# EAGLE design keyboard (EAGLE 7.2.0)
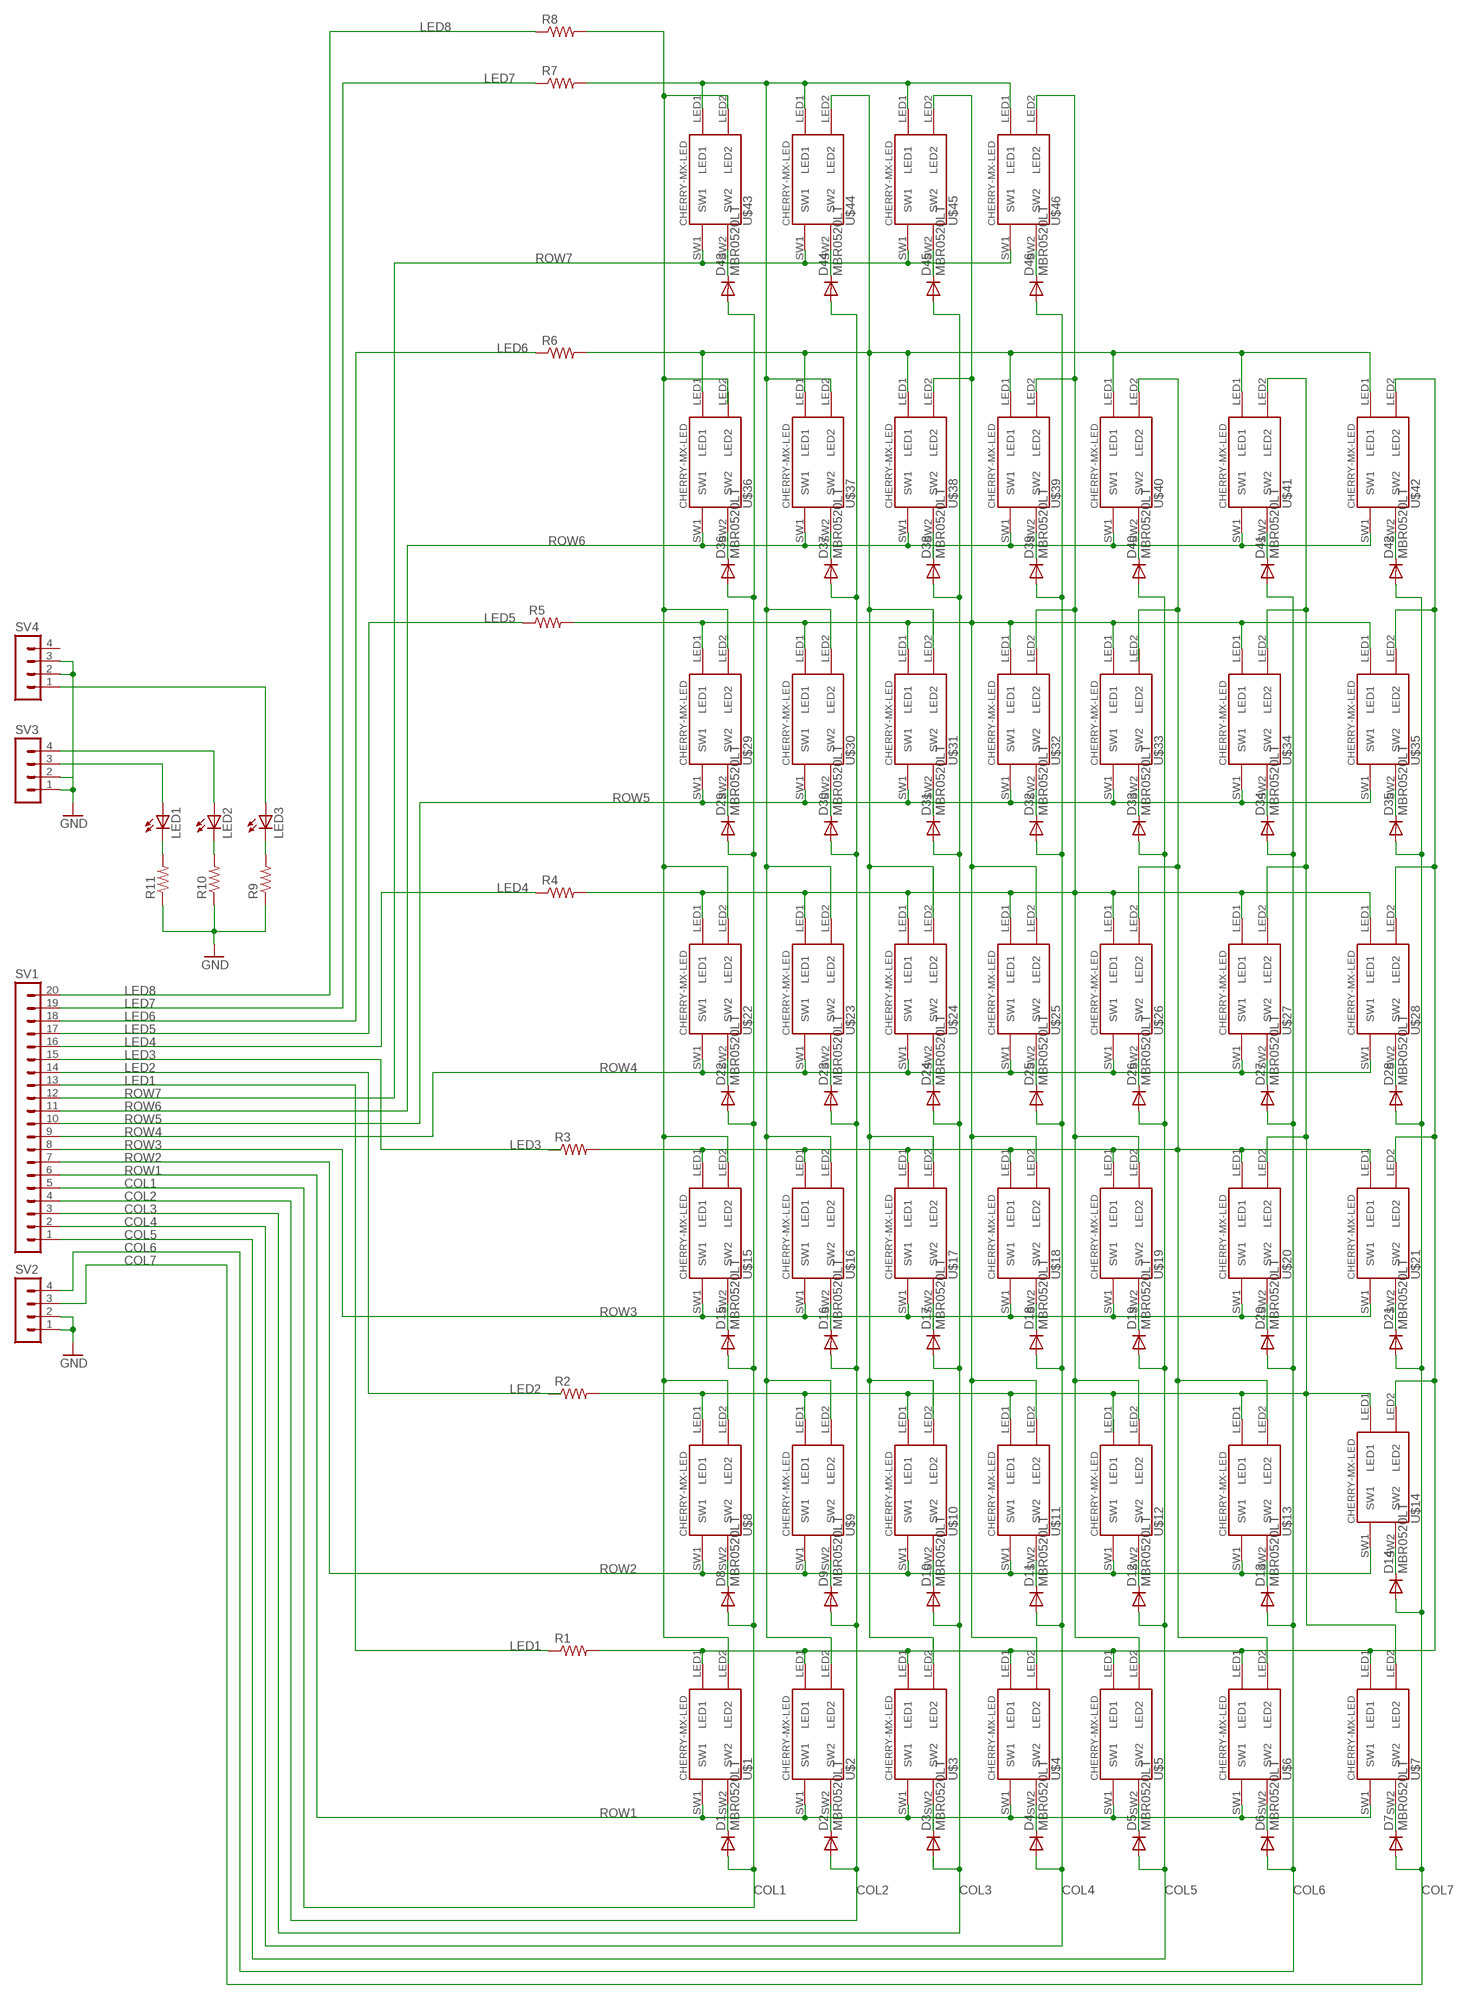
[diagram p0: schematic, sheet 1]

## Parts
D1  MBR0520LT  [SOD123]
D2  MBR0520LT  [SOD123]
D3  MBR0520LT  [SOD123]
D4  MBR0520LT  [SOD123]
D5  MBR0520LT  [SOD123]
D6  MBR0520LT  [SOD123]
D7  MBR0520LT  [SOD123]
D8  MBR0520LT  [SOD123]
D9  MBR0520LT  [SOD123]
D10  MBR0520LT  [SOD123]
D11  MBR0520LT  [SOD123]
D12  MBR0520LT  [SOD123]
D13  MBR0520LT  [SOD123]
D14  MBR0520LT  [SOD123]
D15  MBR0520LT  [SOD123]
D16  MBR0520LT  [SOD123]
D17  MBR0520LT  [SOD123]
D18  MBR0520LT  [SOD123]
D19  MBR0520LT  [SOD123]
D20  MBR0520LT  [SOD123]
D21  MBR0520LT  [SOD123]
D22  MBR0520LT  [SOD123]
D23  MBR0520LT  [SOD123]
D24  MBR0520LT  [SOD123]
D25  MBR0520LT  [SOD123]
D26  MBR0520LT  [SOD123]
D27  MBR0520LT  [SOD123]
D28  MBR0520LT  [SOD123]
D29  MBR0520LT  [SOD123]
D30  MBR0520LT  [SOD123]
D31  MBR0520LT  [SOD123]
D32  MBR0520LT  [SOD123]
D33  MBR0520LT  [SOD123]
D34  MBR0520LT  [SOD123]
D35  MBR0520LT  [SOD123]
D36  MBR0520LT  [SOD123]
D37  MBR0520LT  [SOD123]
D38  MBR0520LT  [SOD123]
D39  MBR0520LT  [SOD123]
D40  MBR0520LT  [SOD123]
D41  MBR0520LT  [SOD123]
D42  MBR0520LT  [SOD123]
D43  MBR0520LT  [SOD123]
D44  MBR0520LT  [SOD123]
D45  MBR0520LT  [SOD123]
D46  MBR0520LT  [SOD123]
LED1  LED5MM  [LED5MM]
LED2  LED5MM  [LED5MM]
LED3  LED5MM  [LED5MM]
R1  R-US_R0603  [R0603]
R2  R-US_R0603  [R0603]
R3  R-US_R0603  [R0603]
R4  R-US_R0603  [R0603]
R5  R-US_R0603  [R0603]
R6  R-US_R0603  [R0603]
R7  R-US_R0603  [R0603]
R8  R-US_R0603  [R0603]
R9  R-US_R0603  [R0603]
R10  R-US_R0603  [R0603]
R11  R-US_R0603  [R0603]
SV1  MA20-1  [MA20-1]
SV2  MA04-1  [MA04-1]
SV3  MA04-1  [MA04-1]
SV4  MA04-1  [MA04-1]
U$1  CHERRY-MX-LED  [CHERRY-MX-LED]
U$2  CHERRY-MX-LED  [CHERRY-MX-LED]
U$3  CHERRY-MX-LED  [CHERRY-MX-LED]
U$4  CHERRY-MX-LED  [CHERRY-MX-LED]
U$5  CHERRY-MX-LED  [CHERRY-MX-LED]
U$6  CHERRY-MX-LED  [CHERRY-MX-LED]
U$7  CHERRY-MX-LED  [CHERRY-MX-LED]
U$8  CHERRY-MX-LED  [CHERRY-MX-LED]
U$9  CHERRY-MX-LED  [CHERRY-MX-LED]
U$10  CHERRY-MX-LED  [CHERRY-MX-LED]
U$11  CHERRY-MX-LED  [CHERRY-MX-LED]
U$12  CHERRY-MX-LED  [CHERRY-MX-LED]
U$13  CHERRY-MX-LED  [CHERRY-MX-LED]
U$14  CHERRY-MX-LED  [CHERRY-MX-LED]
U$15  CHERRY-MX-LED  [CHERRY-MX-LED]
U$16  CHERRY-MX-LED  [CHERRY-MX-LED]
U$17  CHERRY-MX-LED  [CHERRY-MX-LED]
U$18  CHERRY-MX-LED  [CHERRY-MX-LED]
U$19  CHERRY-MX-LED  [CHERRY-MX-LED]
U$20  CHERRY-MX-LED  [CHERRY-MX-LED]
U$21  CHERRY-MX-LED  [CHERRY-MX-LED]
U$22  CHERRY-MX-LED  [CHERRY-MX-LED]
U$23  CHERRY-MX-LED  [CHERRY-MX-LED]
U$24  CHERRY-MX-LED  [CHERRY-MX-LED]
U$25  CHERRY-MX-LED  [CHERRY-MX-LED]
U$26  CHERRY-MX-LED  [CHERRY-MX-LED]
U$27  CHERRY-MX-LED  [CHERRY-MX-LED]
U$28  CHERRY-MX-LED  [CHERRY-MX-LED]
U$29  CHERRY-MX-LED  [CHERRY-MX-LED]
U$30  CHERRY-MX-LED  [CHERRY-MX-LED]
U$31  CHERRY-MX-LED  [CHERRY-MX-LED]
U$32  CHERRY-MX-LED  [CHERRY-MX-LED]
U$33  CHERRY-MX-LED  [CHERRY-MX-LED]
U$34  CHERRY-MX-LED  [CHERRY-MX-LED]
U$35  CHERRY-MX-LED  [CHERRY-MX-LED]
U$36  CHERRY-MX-LED  [CHERRY-MX-LED]
U$37  CHERRY-MX-LED  [CHERRY-MX-LED]
U$38  CHERRY-MX-LED  [CHERRY-MX-LED]
U$39  CHERRY-MX-LED  [CHERRY-MX-LED]
U$40  CHERRY-MX-LED  [CHERRY-MX-LED]
U$41  CHERRY-MX-LED  [CHERRY-MX-LED]
U$42  CHERRY-MX-LED  [CHERRY-MX-LED]
U$43  CHERRY-MX-LED  [CHERRY-MX-LED]
U$44  CHERRY-MX-LED  [CHERRY-MX-LED]
U$45  CHERRY-MX-LED  [CHERRY-MX-LED]
U$46  CHERRY-MX-LED  [CHERRY-MX-LED]

## Nets
COL1: D1.A D8.A D15.A D22.A D29.A D36.A D43.A SV1.5
COL2: D2.A D9.A D16.A D23.A D30.A D37.A D44.A SV1.4
COL3: D3.A D10.A D17.A D24.A D31.A D38.A D45.A SV1.3
COL4: D4.A D11.A D18.A D25.A D32.A D39.A D46.A SV1.2
COL5: D5.A D12.A D19.A D26.A D33.A D40.A SV1.1
COL6: D6.A D13.A D20.A D27.A D34.A D41.A
COL7: D7.A D14.A D21.A D28.A D35.A D42.A SV2.3
GND: R9.1 R10.1 R11.1 SV2.1 SV2.2 SV3.1 SV3.2 SV4.2 SV4.3
LED1: R1.1 SV1.13
LED2: SV1.14
LED3: SV1.15
LED4: R4.1 SV1.16
LED5: R5.1 SV1.17
LED6: R6.1 SV1.18
LED7: R7.1 SV1.19
LED8: R8.1 SV1.20
N$1: D8.C U$8.SW2
N$2: D9.C U$9.SW2
N$3: D10.C U$10.SW2
N$4: D11.C U$11.SW2
N$5: D12.C U$12.SW2
N$6: D13.C U$13.SW2
N$7: D14.C U$14.SW2
N$8: D7.C U$7.SW2
N$9: D6.C U$6.SW2
N$10: D5.C U$5.SW2
N$11: D4.C U$4.SW2
N$12: D3.C U$3.SW2
N$13: D2.C U$2.SW2
N$14: D1.C U$1.SW2
N$15: D15.C U$15.SW2
N$16: D16.C U$16.SW2
N$17: D17.C U$17.SW2
N$18: D18.C U$18.SW2
N$19: D19.C U$19.SW2
N$20: D20.C U$20.SW2
N$21: D21.C U$21.SW2
N$22: D22.C
N$23: D23.C
N$24: D24.C
N$25: D25.C
N$26: D26.C
N$27: D27.C U$27.SW2
N$28: D28.C U$28.SW2
N$29: D29.C U$29.SW2
N$30: D30.C U$30.SW2
N$31: D31.C U$31.SW2
N$32: D32.C U$32.SW2
N$33: D33.C U$33.SW2
N$34: D34.C U$34.SW2
N$35: D35.C U$35.SW2
N$36: D36.C U$36.SW2
N$37: D37.C U$37.SW2
N$38: D38.C U$38.SW2
N$39: D39.C U$39.SW2
N$40: D40.C U$40.SW2
N$41: D41.C U$41.SW2
N$42: D42.C U$42.SW2
N$43: D43.C U$43.SW2
N$44: D44.C U$44.SW2
N$45: D45.C U$45.SW2
N$46: D46.C U$46.SW2
N$48: LED1.K(C) R11.2
N$49: R8.2 U$1.LED2 U$8.LED2 U$15.LED2 U$22.LED2 U$29.LED2 U$43.LED2
N$50: R1.2 U$1.LED1 U$2.LED1 U$3.LED1 U$4.LED1 U$5.LED1 U$6.LED1 U$7.LED1 U$14.LED2 U$21.LED2 U$28.LED2 U$35.LED2 U$42.LED2
N$51: R4.2 U$5.LED2 U$12.LED2 U$19.LED2 U$22.LED1 U$23.LED1 U$24.LED1 U$25.LED1 U$26.LED1 U$27.LED1 U$28.LED1 U$32.LED2 U$39.LED2 U$46.LED2
N$52: R5.2 U$4.LED2 U$11.LED2 U$18.LED2 U$25.LED2 U$29.LED1 U$30.LED1 U$31.LED1 U$32.LED1 U$33.LED1 U$34.LED1 U$35.LED1 U$38.LED2 U$45.LED2
N$53: R6.2 U$3.LED2 U$10.LED2 U$17.LED2 U$24.LED2 U$31.LED2 U$36.LED1 U$37.LED1 U$38.LED1 U$39.LED1 U$40.LED1 U$41.LED1 U$42.LED1 U$44.LED2
N$54: LED2.K(C) R10.2
N$55: LED3.K(C) R9.2
N$58: LED1.A SV3.3
N$59: LED2.A SV3.4
N$60: LED3.A SV4.1
N$64: R7.2 U$2.LED2 U$9.LED2 U$16.LED2 U$23.LED2 U$30.LED2 U$37.LED2 U$43.LED1 U$44.LED1 U$45.LED1 U$46.LED1
N$75: R2.2 U$7.LED2 U$8.LED1 U$9.LED1 U$10.LED1 U$11.LED1 U$13.LED1 U$14.LED1 U$20.LED2 U$27.LED2 U$34.LED2 U$41.LED2
N$76: R3.2 U$6.LED2 U$13.LED2 U$15.LED1 U$16.LED1 U$17.LED1 U$18.LED1 U$19.LED1 U$20.LED1 U$21.LED1 U$26.LED2 U$40.LED2
ROW1: SV1.6 U$1.SW1 U$2.SW1 U$3.SW1 U$4.SW1 U$5.SW1 U$6.SW1 U$7.SW1
ROW2: SV1.7 U$8.SW1 U$9.SW1 U$10.SW1 U$11.SW1 U$12.SW1 U$13.SW1 U$14.SW1
ROW3: SV1.8 U$15.SW1 U$16.SW1 U$17.SW1 U$18.SW1 U$19.SW1 U$20.SW1 U$21.SW1
ROW4: SV1.9 U$22.SW1 U$23.SW1 U$24.SW1 U$25.SW1 U$26.SW1 U$27.SW1 U$28.SW1
ROW5: SV1.10 U$29.SW1 U$30.SW1 U$31.SW1 U$32.SW1 U$33.SW1 U$34.SW1 U$35.SW1
ROW6: SV1.11 U$36.SW1 U$37.SW1 U$38.SW1 U$39.SW1 U$40.SW1 U$41.SW1 U$42.SW1
ROW7: SV1.12 U$43.SW1 U$44.SW1 U$45.SW1 U$46.SW1
Unconnected: R2.1 R3.1 SV2.4 SV4.4 U$12.LED1 U$22.SW2 U$23.SW2 U$24.SW2 U$25.SW2 U$26.SW2 U$33.LED2 U$36.LED2

## Library data of the parts
D1-D46 = dan:MBR0520LT: SCHOTTKY BARRIER RECTIFIER Source: http://onsemi.com .. MBR0520LT1-D.pdf
LED1-LED3 = dan:LED: LED OSRAM: - CHIPLED LG R971, LG N971, LY N971, LG Q971, LY Q971, LO R971, LY R971 LH N974, LH R974 LS Q976, LO Q976, LY Q976 LO Q996 - Hyper CHIPLED LW Q18S LB Q993, LB Q99A, LB R99A - SideLED LS A670, LO A670, LY A670, LG A670, LP A670 LB A673, LV A673, LT A673, LW A673 LH A674 LY A675 LS A676, LA A676, LO A676, LY A676, LW A676 LS A679, LY A679, LG A679 - Hyper Micro SIDELED® LS Y876, LA Y876, LO Y876, LY Y876 LT Y87S - SmartLED LW L88C, LW L88S LB L89C, LB L89S, LG L890 LS L89K, LO L89K, LY L89K LS L896, LA L896, LO L896, LY L896 - TOPLED LS T670, LO T670, LY T670, LG T670, LP T670 LSG T670, LSP T670, LSY T670, LOP T670, LYG T670 LG T671, LOG T671, LSG T671 LB T673, LV T673, LT T673, LW T673 LH T674 LS T676, LA T676, LO T676, LY T676, LB T676, LH T676, LSB T676, LW T676 LB T67C, LV T67C, LT T67C, LS T67K, LO T67K, LY T67K, LW E67C LS E67B, LA E67B, LO E67B, LY E67B, LB E67C, LV E67C, LT E67C LW T67C LS T679, LY T679, LG T679 LS T770, LO T770, LY T770, LG T770, LP T770 LB T773, LV T773, LT T773, LW T773 LH T774 LS E675, LA E675, LY E675, LS T675 LS T776, LA T776, LO T776, LY T776, LB T776 LHGB T686 LT T68C, LB T68C - Hyper Mini TOPLED® LB M676 - Mini TOPLED Santana® LG M470 LS M47K, LO M47K, LY M47K Source: http://www.osram.convergy.de LUXEON: - LUMILED® LXK2-PW12-R00, LXK2-PW12-S00, LXK2-PW14-U00, LXK2-PW14-V00 LXK2-PM12-R00, LXK2-PM12-S00, LXK2-PM14-U00 LXK2-PE12-Q00, LXK2-PE12-R00, LXK2-PE12-S00, LXK2-PE14-T00, LXK2-PE14-U00 LXK2-PB12-K00, LXK2-PB12-L00, LXK2-PB12-M00, LXK2-PB14-N00, LXK2-PB14-P00, LXK2-PB14-Q00 LXK2-PR12-L00, LXK2-PR12-M00, LXK2-PR14-Q00, LXK2-PR14-R00 LXK2-PD12-Q00, LXK2-PD12-R00, LXK2-PD12-S00 LXK2-PH12-R00, LXK2-PH12-S00 LXK2-PL12-P00, LXK2-PL12-Q00, LXK2-PL12-R00 Source: www.luxeon.com KINGBRIGHT: KA-3528ASYC Source: www.kingbright.com
R1-R11 = dan:R-US_: RESISTOR, American symbol
SV1 = dan:MA20-1: PIN HEADER; OC_FARNELL: unknown; OC_NEWARK: unknown
SV2-SV4 = dan:MA04-1: PIN HEADER; OC_FARNELL: unknown; OC_NEWARK: unknown
U$1-U$46 = dan:CHERRY-MX-LED: Cherry MX series keyswitch with LED

## Board
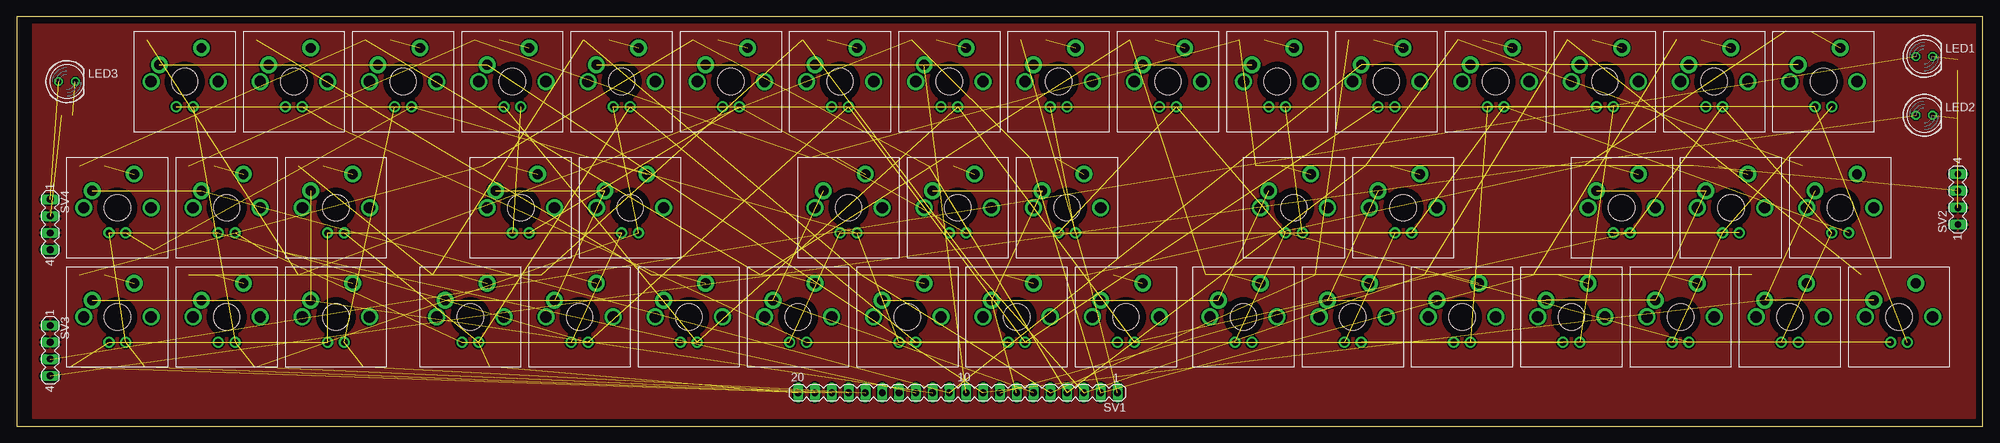
[diagram p1: board, top side]
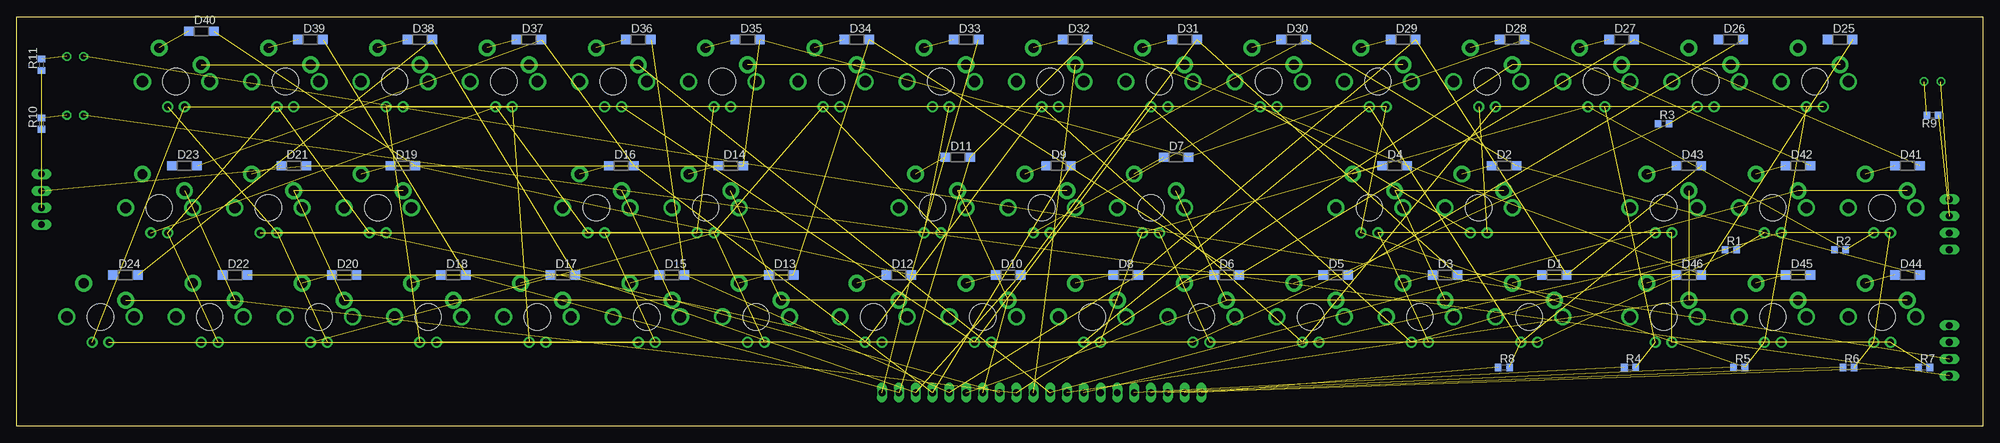
[diagram p2: board, bottom side, seen from below]

Size 297.16 x 61.9 mm. Coordinates in mm from the lower left corner, seen from the top.
Outline: 0,0 297.16,0 297.16,61.9 0,61.9 0,0
Copper layers (1*16): Top 0.035mm / dielectric 1.5mm / Bottom 0.035mm
Design rules "default": minimum track width 10mil, minimum drill 24mil, track to track 8mil, track to pad 8mil, pad to pad 8mil, via to via 8mil, smd to smd 8mil, copper to edge 40mil, drill to drill 8mil, minimum pad ring 10mil, minimum via ring 8mil, stop-mask expansion 4mil, vias tented up to drill 0mil, thermal gap 10mil

### Footprints (pad centres in the part's own frame; a part is rotated, then mirrored left to right if it is on the bottom)
SOD123 = smd 1.4 x 1.4: A 1.9,0; C -1.9,0
LED5MM = drill 0.813 octagon: A -1.27,0; K 1.27,0
R0603 = smd 1 x 1.1: 1 -0.85,0; 2 0.85,0
MA20-1 = drill 1.016 long: 1 -24.13,0; 2 -21.59,0; 3 -19.05,0; 4 -16.51,0; 5 -13.97,0; 6 -11.43,0; 7 -8.89,0; 8 -6.35,0; 9 -3.81,0; 10 -1.27,0; 11 1.27,0; 12 3.81,0; 13 6.35,0; 14 8.89,0; 15 11.43,0; 16 13.97,0; 17 16.51,0; 18 19.05,0; 19 21.59,0; 20 24.13,0
MA04-1 = drill 1.016 long: 1 -3.81,0; 2 -1.27,0; 3 1.27,0; 4 3.81,0
CHERRY-MX-LED = drill 1.016 pad 1.676: LED1 -1.27,-3.81; LED2 1.27,-3.81 | drill 1.714 pad 1.93: P$3 -5.08,0; P$4 5.08,0 | drill 1.5 pad 2.54: SW1 -3.81,2.54; SW2 2.54,5.08 | hole 4: 0,0

### Placement (x,y rotation side)
D1  64.77,22.86 0 bottom
D2  72.39,39.37 0 bottom
D3  81.28,22.86 0 bottom
D4  88.9,39.37 0 bottom
D5  97.79,22.86 0 bottom
D6  114.3,22.86 0 bottom
D7  121.92,40.64 0 bottom
D8  129.54,22.86 0 bottom
D9  139.7,39.37 0 bottom
D10  147.32,22.86 0 bottom
D11  154.94,40.64 0 bottom
D12  163.83,22.86 0 bottom
D13  181.61,22.86 0 bottom
D14  189.23,39.37 0 bottom
D15  198.12,22.86 0 bottom
D16  205.74,39.37 0 bottom
D17  214.63,22.86 0 bottom
D18  231.14,22.86 0 bottom
D19  238.76,39.37 0 bottom
D20  247.65,22.86 0 bottom
D21  255.27,39.37 0 bottom
D22  264.16,22.86 0 bottom
D23  271.78,39.37 0 bottom
D24  280.67,22.86 0 bottom
D25  21.59,58.42 0 bottom
D26  38.1,58.42 0 bottom
D27  54.61,58.42 0 bottom
D28  71.12,58.42 0 bottom
D29  87.63,58.42 0 bottom
D30  104.14,58.42 0 bottom
D31  120.65,58.42 0 bottom
D32  137.16,58.42 0 bottom
D33  153.67,58.42 0 bottom
D34  170.18,58.42 0 bottom
D35  186.69,58.42 0 bottom
D36  203.2,58.42 0 bottom
D37  219.71,58.42 0 bottom
D38  236.22,58.42 0 bottom
D39  252.73,58.42 0 bottom
D40  269.24,59.69 0 bottom
D41  11.43,39.37 0 bottom
D42  27.94,39.37 0 bottom
D43  44.45,39.37 0 bottom
D44  11.43,22.86 0 bottom
D45  27.94,22.86 0 bottom
D46  44.45,22.86 0 bottom
LED1  288.29,55.88 0 top
LED2  288.29,46.99 0 top
LED3  7.62,52.07 0 top
R1  38.1,26.67 0 bottom
R2  21.59,26.67 0 bottom
R3  48.26,45.72 0 bottom
R4  53.34,8.89 0 bottom
R5  36.83,8.89 0 bottom
R6  20.32,8.89 0 bottom
R7  8.89,8.89 0 bottom
R8  72.39,8.89 0 bottom
R9  7.62,46.99 180 bottom
R10  293.37,45.72 90 bottom
R11  293.37,54.61 90 bottom
SV1  142.24,5.08 180 top
SV2  293.37,34.29 90 top
SV3  5.08,11.43 270 top
SV4  5.08,30.48 270 top
U$1  68.58,16.51 0 top
U$2  76.2,33.02 0 top
U$3  85.09,16.51 0 top
U$4  92.71,33.02 0 top
U$5  101.6,16.51 0 top
U$6  118.11,16.51 0 top
U$7  125.73,33.02 0 top
U$8  134.62,16.51 0 top
U$9  142.24,33.02 0 top
U$10  151.13,16.51 0 top
U$11  158.75,33.02 0 top
U$12  167.64,16.51 0 top
U$13  185.42,16.51 0 top
U$14  193.04,33.02 0 top
U$15  201.93,16.51 0 top
U$16  209.55,33.02 0 top
U$17  218.44,16.51 0 top
U$18  234.95,16.51 0 top
U$19  242.57,33.02 0 top
U$20  251.46,16.51 0 top
U$21  259.08,33.02 0 top
U$22  267.97,16.51 0 top
U$23  275.59,33.02 0 top
U$24  284.48,16.51 0 top
U$25  25.4,52.07 0 top
U$26  41.91,52.07 0 top
U$27  58.42,52.07 0 top
U$28  74.93,52.07 0 top
U$29  91.44,52.07 0 top
U$30  107.95,52.07 0 top
U$31  124.46,52.07 0 top
U$32  140.97,52.07 0 top
U$33  157.48,52.07 0 top
U$34  173.99,52.07 0 top
U$35  190.5,52.07 0 top
U$36  207.01,52.07 0 top
U$37  223.52,52.07 0 top
U$38  240.03,52.07 0 top
U$39  256.54,52.07 0 top
U$40  273.05,52.07 0 top
U$41  15.24,33.02 0 top
U$42  31.75,33.02 0 top
U$43  48.26,33.02 0 top
U$44  15.24,16.51 0 top
U$45  31.75,16.51 0 top
U$46  48.26,16.51 0 top

### Tracks (layer width: path | path; a pad name or v marks a point on that pad's centre or on a via)
COL1  (7 unrouted)
COL2  (7 unrouted)
COL3  (7 unrouted)
COL4  (7 unrouted)
COL5  (6 unrouted)
COL6  (5 unrouted)
COL7  (6 unrouted)
GND  (3 unrouted)
  pour Top: 2.54,62.23 295.91,62.23 295.91,1.27 2.54,1.27
LED1  (1 unrouted)
LED4  (1 unrouted)
LED5  (1 unrouted)
LED6  (1 unrouted)
LED7  (1 unrouted)
LED8  (1 unrouted)
N$1  (1 unrouted)
N$2  (1 unrouted)
N$3  (1 unrouted)
N$4  (1 unrouted)
N$5  (1 unrouted)
N$6  (1 unrouted)
N$7  (1 unrouted)
N$8  (1 unrouted)
N$9  (1 unrouted)
N$10  (1 unrouted)
N$11  (1 unrouted)
N$12  (1 unrouted)
N$13  (1 unrouted)
N$14  (1 unrouted)
N$15  (1 unrouted)
N$16  (1 unrouted)
N$17  (1 unrouted)
N$18  (1 unrouted)
N$19  (1 unrouted)
N$20  (1 unrouted)
N$21  (1 unrouted)
N$27  (1 unrouted)
N$28  (1 unrouted)
N$29  (1 unrouted)
N$30  (1 unrouted)
N$31  (1 unrouted)
N$32  (1 unrouted)
N$33  (1 unrouted)
N$34  (1 unrouted)
N$35  (1 unrouted)
N$36  (1 unrouted)
N$37  (1 unrouted)
N$38  (1 unrouted)
N$39  (1 unrouted)
N$40  (1 unrouted)
N$41  (1 unrouted)
N$42  (1 unrouted)
N$43  (1 unrouted)
N$44  (1 unrouted)
N$45  (1 unrouted)
N$46  (1 unrouted)
N$48  (1 unrouted)
N$49  (6 unrouted)
N$50  (12 unrouted)
N$51  (13 unrouted)
N$52  (13 unrouted)
N$53  (13 unrouted)
N$54  (1 unrouted)
N$55  (1 unrouted)
N$58  (1 unrouted)
N$59  (1 unrouted)
N$60  (1 unrouted)
N$64  (10 unrouted)
N$75  (11 unrouted)
N$76  (11 unrouted)
ROW1  (7 unrouted)
ROW2  (7 unrouted)
ROW3  (7 unrouted)
ROW4  (7 unrouted)
ROW5  (7 unrouted)
ROW6  (7 unrouted)
ROW7  (4 unrouted)